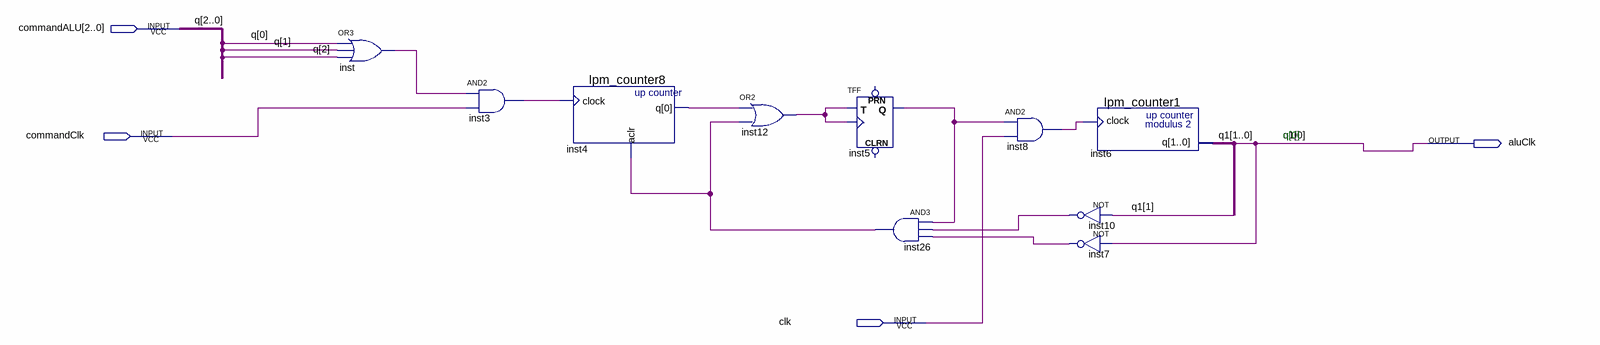
[diagram p0: schematic sheet]
// Quartus schematic ALUcontrol.bdf as structural Verilog: 10 symbols, 4 pins
module ALUcontrol (
  input  [2:0] commandALU,
  input  commandClk,
  input  clk,
  output aluClk
);

  wire inst3_out, inst4_q, inst5_q, inst7_out, inst8_out, inst10_out, inst12_out, inst26_out, inst_out;
  wire [1:1] q1;

  or inst (inst_out, commandALU[0], commandALU[1], commandALU[2]);
  and inst3 (inst3_out, inst_out, commandClk);
  lpm_counter8 inst4 (.clock(inst3_out), .aclr(inst26_out), .q(inst4_q));
  or inst12 (inst12_out, inst4_q, inst26_out);
  TFF inst5 (.T(inst12_out), .CLK(inst12_out), .Q(inst5_q));  // open: PRN, CLRN
  and inst26 (inst26_out, inst5_q, inst10_out, inst7_out);
  and inst8 (inst8_out, inst5_q, clk);
  lpm_counter1 inst6 (.clock(inst8_out), .q({q1[1], aluClk}));
  not inst10 (inst10_out, q1[1]);
  not inst7 (inst7_out, aluClk);

  // Other names for the same wires on the sheet: q1[0] = aluClk; q[2:0] = commandALU

  // Notes on the sheet:
  //   q[0]
endmodule
